# Altium project PCB-Tester-Board-V1.PrjPcb (part 1 of 3)
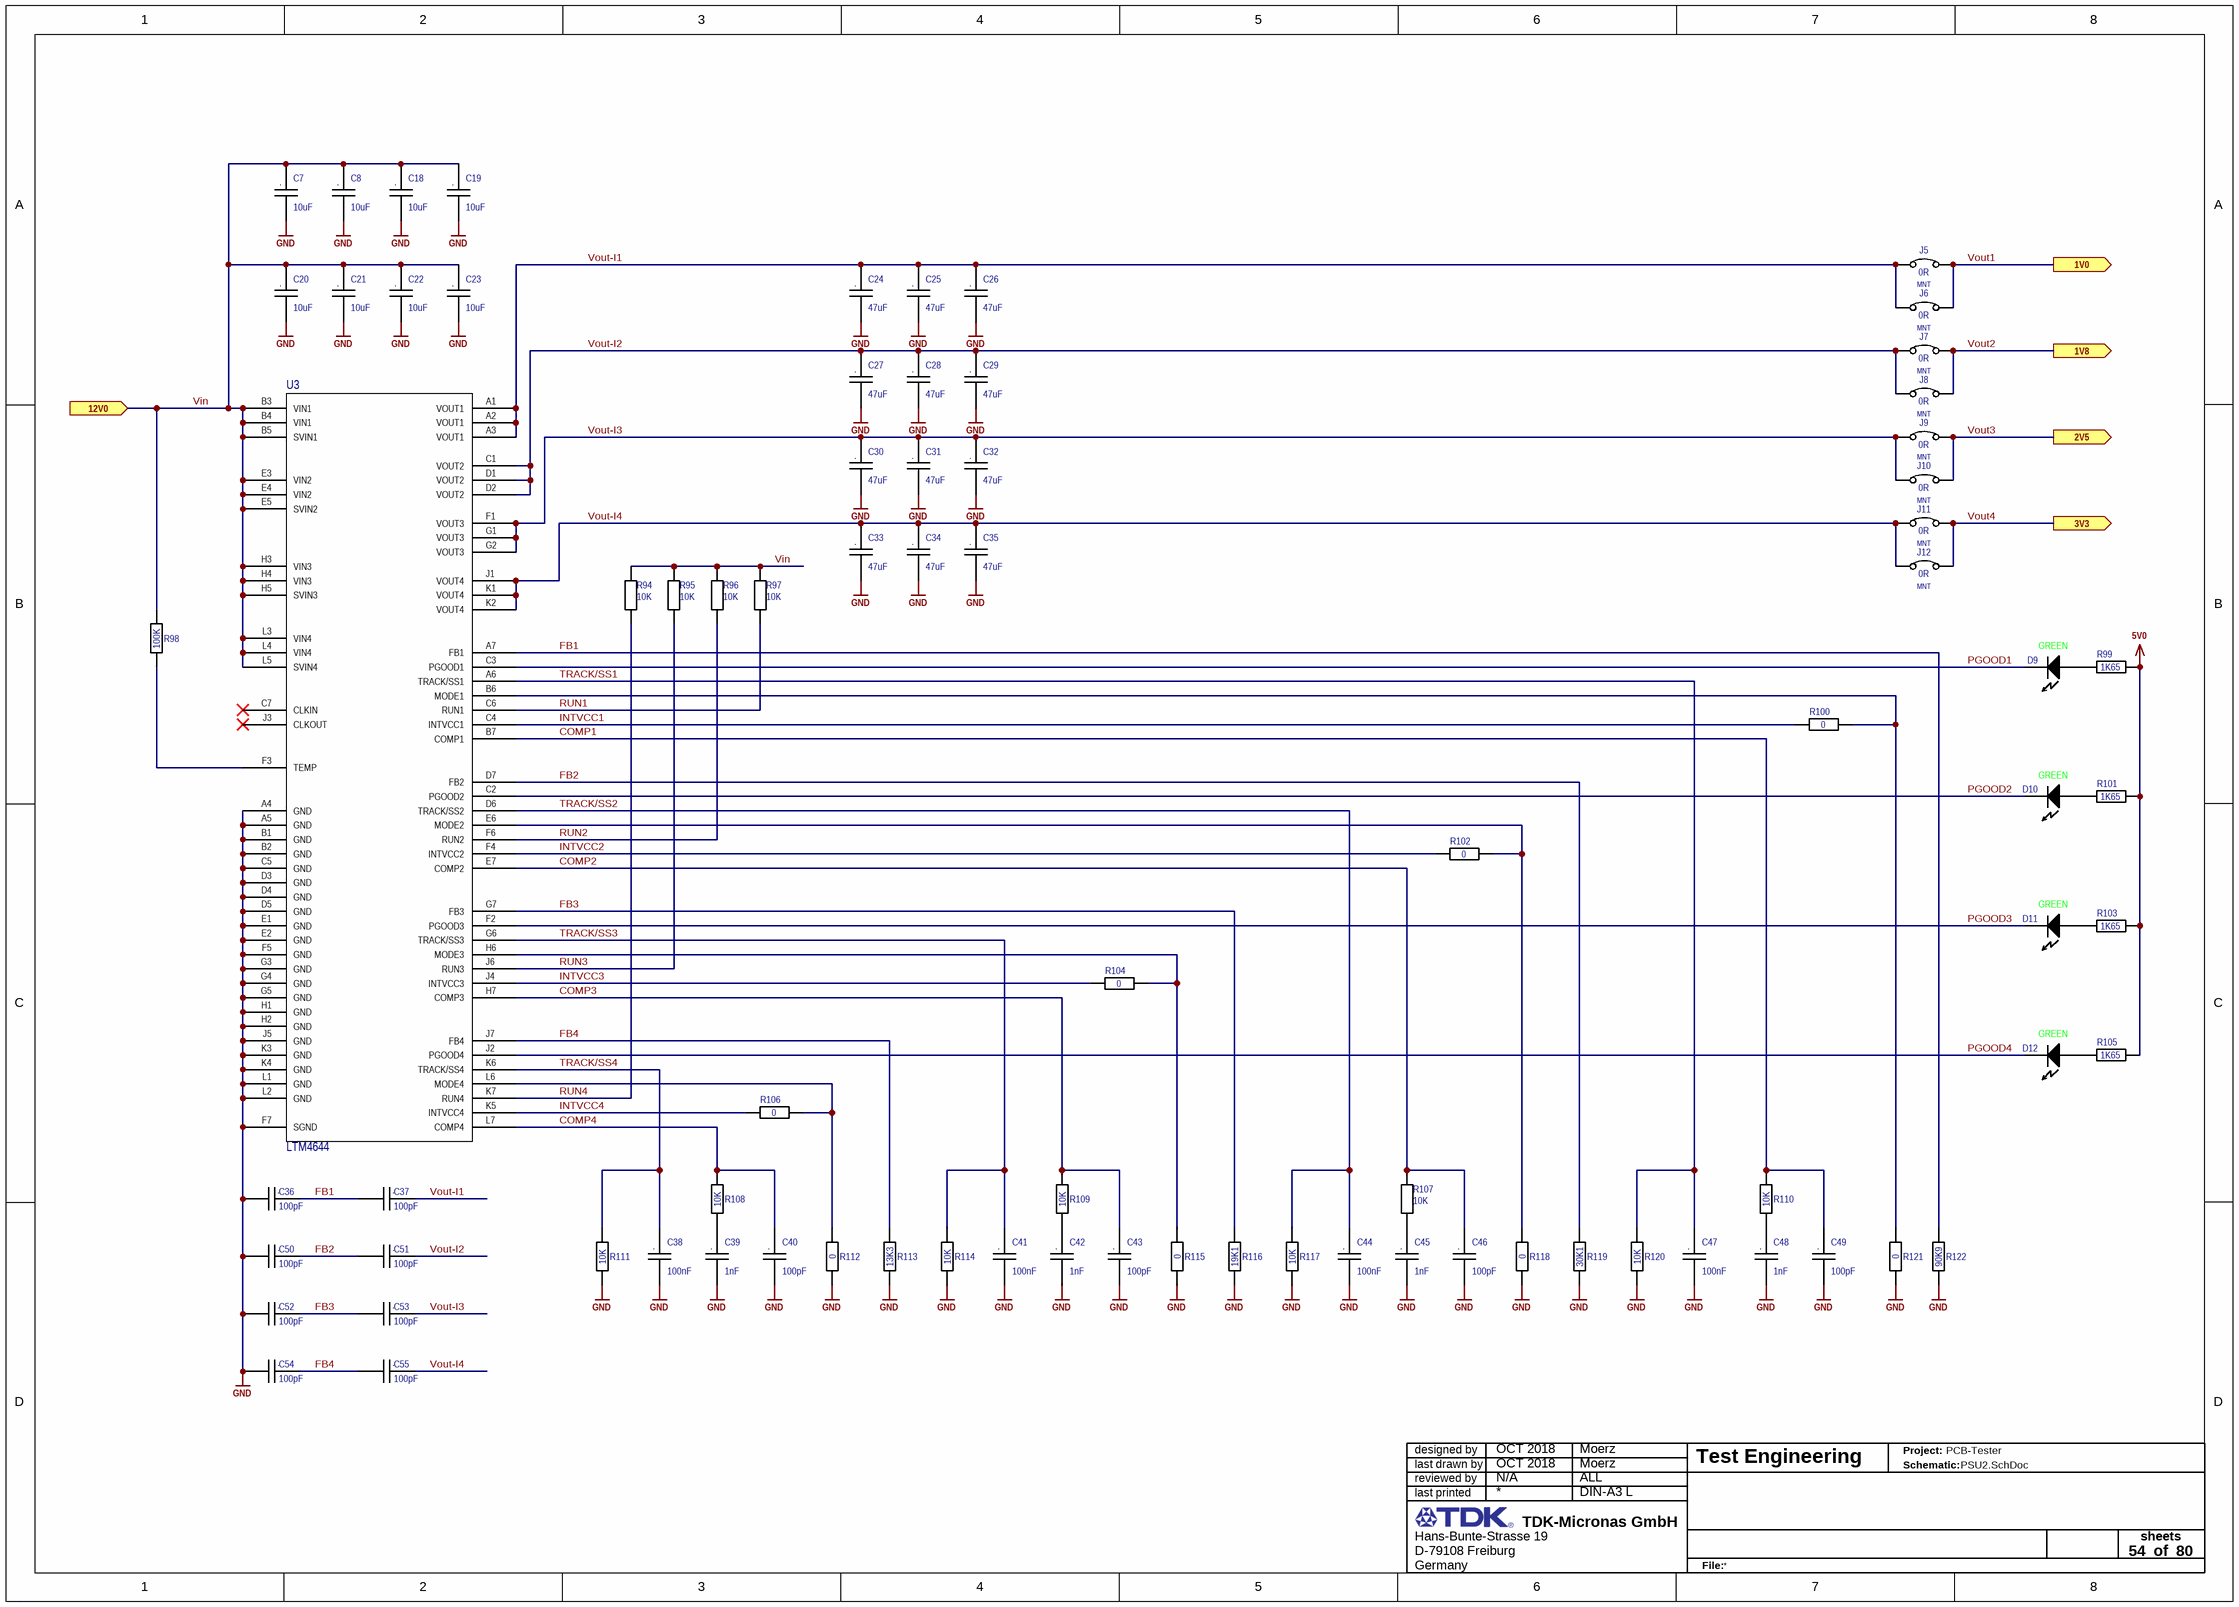
[diagram p0: PSU2.SchDoc]
A_Number: A33003; Board: PCB-Tester-Board; BoardNumber: U33xxx; MajorRevision: 1; MinorRevision: 0; Project: PCB-Tester; Team: Test Engineering; U_Number: U33xxx
13 sheets, 574 parts. Net scope: hierarchical (ports join the sheet entries above them; power ports are global).
Board file: PCB-Tester-Board-V1.PcbDoc
Sheets:
  PSU2.SchDoc
  X7A15T-Decoupling.SchDoc
  PCB-Tester-Board-V1.SchDoc
    Instrument1 = Instrument.SchDoc
    Instrument2 = Instrument.SchDoc
    Instrument3 = Instrument.SchDoc
    Instrument4 = Instrument.SchDoc
    Instrument5 = Instrument.SchDoc
    Instrument6 = Instrument.SchDoc
    Instrument7 = Instrument.SchDoc
    Instrument8 = Instrument.SchDoc
    Controller = Controller.SchDoc
      ADC = ADC.SchDoc
      RelayDriver = RelayDriver.SchDoc
        X7A15T-Prog = X7A15T-Prog.SchDoc
        X7A15T-Fabric = X7A15T-Fabric.SchDoc
      Input = Input.SchDoc
      Output = Output.SchDoc
      Output = Output.SchDoc
      Output = Output.SchDoc
      Output = Output.SchDoc
      Output = Output.SchDoc
      Input = Input.SchDoc
      Input = Input.SchDoc
      Input = Input.SchDoc
      Input = Input.SchDoc
    Power Routing = PowerRouting.SchDoc
    Signal Routing = SignalRouting.SchDoc

## Sheet PSU2.SchDoc: =Board +' X7A15T-PSU-LTTM4644'
size A3; Date: OCT 2018; CheckedBy: ALL; Author: Moerz; CompanyName: TDK-Micronas GmbH; DrawnBy: Moerz; Engineer: Moerz; Organization: Test Engineering; Address1: Hans-Bunte-Strasse 19; Address2: D-79108 Freiburg; Address3: Germany; DocumentNumber: U33xxx-S; Revision: V1.0; SheetNumber: 54; SheetTotal: 80; DateDraw: OCT 2018; DateChecked: N/A; PageSetup: Record=PageOptions|CenterHorizontal=True|CenterVertical=True|PrintScale=0.97|XCorrection=1.00|YCorrection=1.00|PrintKind=0|BorderSize=5000000|LeftOffset=0|BottomOffset=0|Orientation=2|PaperLength=1000|PaperWidth=1000|Scale=100|PaperSource=7|PrintQuality=-3|MediaType=1|DitherType=10|PrintScaleMode=1|PaperKind=A4|PaperIndex=9; TitleTyp: Title-Typ; Block: CPU & SCT8; Workspace: Workspace

### Parts
C7  value 10uF  [C1206 Reflow]  (hidden comment: C)
C8  value 10uF  [C1206 Reflow]  (hidden comment: C)
C18  value 10uF  [C1206 Reflow]  (hidden comment: C)
C19  value 10uF  [C1206 Reflow]  (hidden comment: C)
C20  value 10uF  [C1206 Reflow]  (hidden comment: C)
C21  value 10uF  [C1206 Reflow]  (hidden comment: C)
C22  value 10uF  [C1206 Reflow]  (hidden comment: C)
C23  value 10uF  [C1206 Reflow]  (hidden comment: C)
C24  value 47uF  [C1210 Reflow]  (hidden comment: C)
C25  value 47uF  [C1210 Reflow]  (hidden comment: C)
C26  value 47uF  [C1210 Reflow]  (hidden comment: C)
C27  value 47uF  [C1210 Reflow]  (hidden comment: C)
C28  value 47uF  [C1210 Reflow]  (hidden comment: C)
C29  value 47uF  [C1210 Reflow]  (hidden comment: C)
C30  value 47uF  [C1210 Reflow]  (hidden comment: C)
C31  value 47uF  [C1210 Reflow]  (hidden comment: C)
C32  value 47uF  [C1210 Reflow]  (hidden comment: C)
C33  value 47uF  [C1210 Reflow]  (hidden comment: C)
C34  value 47uF  [C1210 Reflow]  (hidden comment: C)
C35  value 47uF  [C1210 Reflow]  (hidden comment: C)
C36  value 100pF  [C0402 Reflow]  (hidden comment: C)
C37  value 100pF  [C0402 Reflow]  (hidden comment: C)
C38  value 100nF  [C0402 Reflow]  (hidden comment: C)
C39  value 1nF  [C0402 Reflow]  (hidden comment: C)
C40  value 100pF  [C0402 Reflow]  (hidden comment: C)
C41  value 100nF  [C0402 Reflow]  (hidden comment: C)
C42  value 1nF  [C0402 Reflow]  (hidden comment: C)
C43  value 100pF  [C0402 Reflow]  (hidden comment: C)
C44  value 100nF  [C0402 Reflow]  (hidden comment: C)
C45  value 1nF  [C0402 Reflow]  (hidden comment: C)
C46  value 100pF  [C0402 Reflow]  (hidden comment: C)
C47  value 100nF  [C0402 Reflow]  (hidden comment: C)
C48  value 1nF  [C0402 Reflow]  (hidden comment: C)
C49  value 100pF  [C0402 Reflow]  (hidden comment: C)
C50  value 100pF  [C0402 Reflow]  (hidden comment: C)
C51  value 100pF  [C0402 Reflow]  (hidden comment: C)
C52  value 100pF  [C0402 Reflow]  (hidden comment: C)
C53  value 100pF  [C0402 Reflow]  (hidden comment: C)
C54  value 100pF  [C0402 Reflow]  (hidden comment: C)
C55  value 100pF  [C0402 Reflow]  (hidden comment: C)
D9  Color: GREEN  [L0603G]  (hidden comment: D)
D10  Color: GREEN  [L0603G]  (hidden comment: D)
D11  Color: GREEN  [L0603G]  (hidden comment: D)
D12  Color: GREEN  [L0603G]  (hidden comment: D)
J5  value 0R  POPULATED: MNT  [JumperSMD]  (hidden comment: J)
J6  value 0R  POPULATED: MNT  [JumperSMD]  (hidden comment: J)
J7  value 0R  POPULATED: MNT  [JumperSMD]  (hidden comment: J)
J8  value 0R  POPULATED: MNT  [JumperSMD]  (hidden comment: J)
J9  value 0R  POPULATED: MNT  [JumperSMD]  (hidden comment: J)
J10  value 0R  POPULATED: MNT  [JumperSMD]  (hidden comment: J)
J11  value 0R  POPULATED: MNT  [JumperSMD]  (hidden comment: J)
J12  value 0R  POPULATED: MNT  [JumperSMD]  (hidden comment: J)
R94  value 10K  [R0402 Reflow]  (hidden comment: R)
R95  value 10K  [R0402 Reflow]  (hidden comment: R)
R96  value 10K  [R0402 Reflow]  (hidden comment: R)
R97  value 10K  [R0402 Reflow]  (hidden comment: R)
R98  value 100K  [R0402 Reflow]  (hidden comment: R)
R99  value 1K65  [R0402 Reflow]  (hidden comment: R)
R100  value 0  [R0402 Reflow]  (hidden comment: R)
R101  value 1K65  [R0402 Reflow]  (hidden comment: R)
R102  value 0  [R0402 Reflow]  (hidden comment: R)
R103  value 1K65  [R0402 Reflow]  (hidden comment: R)
R104  value 0  [R0402 Reflow]  (hidden comment: R)
R105  value 1K65  [R0402 Reflow]  (hidden comment: R)
R106  value 0  [R0402 Reflow]  (hidden comment: R)
R107  value 10K  [R0402 Reflow]  (hidden comment: R)
R108  value 10K  [R0402 Reflow]  (hidden comment: R)
R109  value 10K  [R0402 Reflow]  (hidden comment: R)
R110  value 10K  [R0402 Reflow]  (hidden comment: R)
R111  value 10K  [R0402 Reflow]  (hidden comment: R)
R112  value 0  [R0402 Reflow]  (hidden comment: R)
R113  value 13K3  [R0402 Reflow]  (hidden comment: R)
R114  value 10K  [R0402 Reflow]  (hidden comment: R)
R115  value 0  [R0402 Reflow]  (hidden comment: R)
R116  value 19K1  [R0402 Reflow]  (hidden comment: R)
R117  value 10K  [R0402 Reflow]  (hidden comment: R)
R118  value 0  [R0402 Reflow]  (hidden comment: R)
R119  value 30K1  [R0402 Reflow]  (hidden comment: R)
R120  value 10K  [R0402 Reflow]  (hidden comment: R)
R121  value 0  [R0402 Reflow]  (hidden comment: R)
R122  value 90K9  [R0402 Reflow]  (hidden comment: R)
U3  U  [LTM4644]  (value not drawn)

### Ports
1V0 (out), 1V8 (out), 2V5 (out), 3V3 (out), 12V0 (in)

### Nets
5V0: R99.2 R101.2 R103.2 R105.2
GND: C7.2 C8.2 C18.2 C19.2 C20.2 C21.2 C22.2 C23.2 C24.2 C25.2 C26.2 C27.2 C28.2 C29.2 C30.2 C31.2 C32.2 C33.2 C34.2 C35.2 C36.2 C38.2 C39.2 C40.2 C41.2 C42.2 C43.2 C44.2 C45.2 C46.2 C47.2 C48.2 C49.2 C50.2 C52.2 C54.2 R111.1 R112.1 R113.1 R114.1 R115.1 R116.1 R117.1 R118.1 R119.1 R120.1 R121.1 R122.1 U3.A4(GND) U3.A5(GND) U3.B1(GND) U3.B2(GND) U3.C5(GND) U3.D3(GND) U3.D4(GND) U3.D5(GND) U3.E1(GND) U3.E2(GND) U3.F5(GND) U3.F7(SGND) U3.G3(GND) U3.G4(GND) U3.G5(GND) U3.H1(GND) U3.H2(GND) U3.J5(GND) U3.K3(GND) U3.K4(GND) U3.L1(GND) U3.L2(GND)
COMP1: C49.1 R110.2 U3.B7(COMP1)  [project net COMP1_54]
COMP2: C46.1 R107.2 U3.E7(COMP2)  [project net COMP2_54]
COMP3: C43.1 R109.2 U3.H7(COMP3)  [project net COMP3_54]
COMP4: C40.1 R108.2 U3.L7(COMP4)  [project net COMP4_54]
FB1: C36.1 C37.2 R122.2 U3.A7(FB1)  [project net FB1_54]
FB2: C50.1 C51.2 R119.2 U3.D7(FB2)  [project net FB2_54]
FB3: C52.1 C53.2 R116.2 U3.G7(FB3)  [project net FB3_54]
FB4: C54.1 C55.2 R113.2 U3.J7(FB4)  [project net FB4_54]
INTVCC1: R100.2 U3.C4(INTVCC1)  [project net INTVCC1_54]
INTVCC2: R102.2 U3.F4(INTVCC2)  [project net INTVCC2_54]
INTVCC3: R104.2 U3.J4(INTVCC3)  [project net INTVCC3_54]
INTVCC4: R106.2 U3.K5(INTVCC4)  [project net INTVCC4_54]
PGOOD1: D9.2(Cathode) U3.C3(PGOOD1)  [project net PGOOD1_54]
PGOOD2: D10.2(Cathode) U3.C2(PGOOD2)  [project net PGOOD2_54]
PGOOD3: D11.2(Cathode) U3.F2(PGOOD3)  [project net PGOOD3_54]
PGOOD4: D12.2(Cathode) U3.J2(PGOOD4)  [project net PGOOD4_54]
RUN1: R97.1 U3.C6(RUN1)  [project net RUN1_54]
RUN2: R96.1 U3.F6(RUN2)  [project net RUN2_54]
RUN3: R95.1 U3.J6(RUN3)  [project net RUN3_54]
RUN4: R94.1 U3.K7(RUN4)  [project net RUN4_54]
TRACK/SS1: C47.1 R120.2 U3.A6(TRACK/SS1)  [project net TRACK/SS1_54]
TRACK/SS2: C44.1 R117.2 U3.D6(TRACK/SS2)  [project net TRACK/SS2_54]
TRACK/SS3: C41.1 R114.2 U3.G6(TRACK/SS3)  [project net TRACK/SS3_54]
TRACK/SS4: C38.1 R111.2 U3.K6(TRACK/SS4)  [project net TRACK/SS4_54]
Vin: C7.1 C8.1 C18.1 C19.1 C20.1 C21.1 C22.1 C23.1 R94.2 R95.2 R96.2 R97.2 R98.2 U3.B3(VIN1) U3.B4(VIN1) U3.B5(SVIN1) U3.E3(VIN2) U3.E4(VIN2) U3.E5(SVIN2) U3.H3(VIN3) U3.H4(VIN3) U3.H5(SVIN3) U3.L3(VIN4) U3.L4(VIN4) U3.L5(SVIN4) ; port 12V0
Vout1: J5.2 J6.2 ; port 1V0
Vout2: J7.2 J8.2 ; port 1V8
Vout3: J9.2 J10.2 ; port 2V5
Vout4: J11.2 J12.2 ; port 3V3
Vout-I1: C24.1 C25.1 C26.1 C37.1 J5.1 J6.1 U3.A1(VOUT1) U3.A2(VOUT1) U3.A3(VOUT1)  [project net Vout-I1_54]
Vout-I2: C27.1 C28.1 C29.1 C51.1 J7.1 J8.1 U3.C1(VOUT2) U3.D1(VOUT2) U3.D2(VOUT2)  [project net Vout-I2_54]
Vout-I3: C30.1 C31.1 C32.1 C53.1 J9.1 J10.1 U3.F1(VOUT3) U3.G1(VOUT3) U3.G2(VOUT3)  [project net Vout-I3_54]
Vout-I4: C33.1 C34.1 C35.1 C55.1 J11.1 J12.1 U3.J1(VOUT4) U3.K1(VOUT4) U3.K2(VOUT4)  [project net Vout-I4_54]
NetC39_1: C39.1 R108.1
NetC42_1: C42.1 R109.1
NetC45_1: C45.1 R107.1
NetC48_1: C48.1 R110.1
NetD9_1: D9.1(Anode) R99.1
NetD10_1: D10.1(Anode) R101.1
NetD11_1: D11.1(Anode) R103.1
NetD12_1: D12.1(Anode) R105.1
NetR98_1: R98.1 U3.F3(TEMP)
NetR100_1: R100.1 R121.2 U3.B6(MODE1)
NetR102_1: R102.1 R118.2 U3.E6(MODE2)
NetR104_1: R104.1 R115.2 U3.H6(MODE3)
NetR106_1: R106.1 R112.2 U3.L6(MODE4)

Not connected (* = marked no-connect by the designer): U3 C7(CLKIN)* J3(CLKOUT)*

### Notes on the sheet
- designed by
- reviewed by
- last drawn by
- Project:
- Schematic:
- last printed
- DIN-A3 L
- sheets
- of
- File:
- (in symbol C) .

### Library data of the parts
C7 C8 C18-C23 = C: CAP CER 10UF 25V X7R 1206; 04. Manufacturer: TDK Corporation; 07. Manufacturer  Part Number: C3216X7R1E106K160AB; Tolerance: ±10%; 03. Unit Price: 0.66; 13. Created Date/Name: AUG2018/Hören; Voltage Rating: 25V; Type: X7R; ComponentLink1Description: Info; ComponentLink1URL: https://www.digikey.de/products/en?keywords=445-7705-6-ND; 02. Distributor Part Number: 445-7705-6-ND; 09. Operating Temperature: -55°C ~ 125°C; 11. RoHS: YES; 01. Distributor: DigiKey; ComponentLink2Description: DataSheet; Package: 1206
C24-C35 = C: CAP CER 47UF 10V X5R 1210; 04. Manufacturer: Samsung Electro-Mechanics; 07. Manufacturer  Part Number: CL32A476MPJNNNE; Tolerance: ±20%; 03. Unit Price: 0.88; 13. Created Date/Name: AUG2018/Hören; Voltage Rating: 10V; Type: X5R; ComponentLink1Description: Info; ComponentLink1URL: *; 02. Distributor Part Number: 1276-3380-6-ND; 09. Operating Temperature: -55°C ~ 85°C; 11. RoHS: YES; 01. Distributor: DigiKey; ComponentLink2Description: DataSheet; Package: 1210
C36 C37 C40 C43 C46 C49-C55 = C: CAP CER 100PF 25V C0G/NP0 0402; 04. Manufacturer: KEMET; 07. Manufacturer  Part Number: C0402C101J3GACTU; Tolerance: ±5%; Type: C0G, NP0; 03. Unit Price: 0.09; 13. Created Date/Name: AUG2018/Hören; Voltage Rating: 25V; ComponentLink1Description: Info; ComponentLink1URL: https://www.digikey.de/products/en?keywords=399-1022-6-ND; 02. Distributor Part Number: 399-1022-6-ND; 09. Operating Temperature: -55°C ~ 125°C; 11. RoHS: YES; 01. Distributor: DigiKey; ComponentLink2Description: DataSheet; Package: 0402
C38 C41 C44 C47 = C: CAP CER 0.1UF 25V X7R 0402; 04. Manufacturer: Yageo; 07. Manufacturer  Part Number: CC0402KRX7R8BB104; Tolerance: ±10%; 03. Unit Price: 0.09; 13. Created Date/Name: AUG2018/Hören; Voltage Rating: 25V; Type: X7R; ComponentLink1Description: Info; ComponentLink1URL: https://www.digikey.de/products/en?keywords=311-2077-6-ND; 02. Distributor Part Number: 311-2077-6-ND; 09. Operating Temperature: -55°C ~ 125°C; 11. RoHS: YES; 01. Distributor: DigiKey; ComponentLink2Description: DataSheet; Package: 0402
C39 C42 C45 C48 = C: CAP CER 1000PF 25V X7R 0402; 04. Manufacturer: KEMET; 07. Manufacturer  Part Number: C0402C102K3RACTU; Tolerance: ±10%; 03. Unit Price: 0.09; 13. Created Date/Name: AUG2018/Hören; Voltage Rating: 25V; Type: X7R; ComponentLink1Description: Info; ComponentLink1URL: https://www.digikey.de/products/en?keywords=399-1031-6-ND; 02. Distributor Part Number: 399-1031-6-ND; 09. Operating Temperature: -55°C ~ 125°C; 11. RoHS: YES; 01. Distributor: DigiKey; ComponentLink2Description: DataSheet; Package: 0402
D9-D12 = LED: LED GREEN DIFFUSED 0603 SMD; 04. Manufacturer: OSRAM Opto Semiconductors Inc.; 07. Manufacturer  Part Number: LG L29K-G2J1-24-Z; Vf: 1.7V; If: 2mA; Wave Length: 570nm; Viewing Angle: 160°; 03. Unit Price: 0.4; 13. Created Date/Name: AUG2018/Hören; ComponentLink1Description: Info; ComponentLink1URL: https://www.digikey.de/products/en?keywords=475-2709-6-ND; ComponentLink2Description: DataSheet; ComponentLink2URL: https://www.digikey.de/products/en?keywords=475-2709-6-ND; 02. Distributor Part Number: 475-2709-6-ND; 11. RoHS: YES; 01. Distributor: DigiKey
J5-J12 = Jumper SMD: RES SMD 0 OHM JUMPER 1/10W 0603; 04. Manufacturer: Yageo; 07. Manufacturer  Part Number: RC0603JR-070RL; 03. Unit Price: 0.09; 01. Distributor: DigiKey; 02. Distributor Part Number: 311-0.0GRDKR-ND; 09. Operating Temperature: -55°C ~ 155°C; 11. RoHS: YES; Package: 0603; ComponentLink4Description: Info; ComponentLink4URL: https://www.digikey.de/product-detail/en/yageo/RC0603JR-070RL/311-0.0GRDKR-ND/732569; ComponentLink5Description: DataSheet; ComponentLink5URL: http://www.yageo.com/documents/recent/PYu-RC_Group_51_RoHS_L_10.pdf
R94-R97 R107-R111 R114 R117 R120 = R: RES SMD 10K OHM 1% 1/16W 0402; 04. Manufacturer: Yageo; 07. Manufacturer  Part Number: RC0402FR-0710KL; 03. Unit Price: 0.09; 13. Created Date/Name: AUG2018/Hören; Power Rating: 63mW; Tolerance: ±1%; ComponentLink1URL: https://www.digikey.de/products/en?keywords=311-10.0KLRDKR-ND; ComponentLink1Description: Info; 02. Distributor Part Number: 311-10.0KLRDKR-ND; 09. Operating Temperature: -55°C ~ 155°C; 11. RoHS: YES; 01. Distributor: DigiKey; ComponentLink2Description: DataSheet; Type: Thick Film; Package: 0402
R98 = R: RES SMD 100K OHM 1% 1/16W 0402; 04. Manufacturer: Yageo; 07. Manufacturer  Part Number: RC0402FR-07100KL; 03. Unit Price: 0.09; 13. Created Date/Name: AUG2018/Hören; Power Rating: 63mW; Tolerance: ±1%; ComponentLink1URL: *; ComponentLink1Description: Info; 02. Distributor Part Number: 311-100KLRDKR-ND; 09. Operating Temperature: -55°C ~ 155°C; 11. RoHS: YES; 01. Distributor: DigiKey; ComponentLink2Description: DataSheet; Type: Thick Film; Package: 0402
R99 R101 R103 R105 = R: RES SMD 1.65K OHM 1% 1/16W 0402; 04. Manufacturer: Yageo; 07. Manufacturer  Part Number: RC0402FR-071K65L; 03. Unit Price: 0.09; 13. Created Date/Name: AUG2018/Hören; Power Rating: 63mW; Tolerance: ±1%; ComponentLink1URL: https://www.digikey.de/product-detail/en/yageo/RC0402FR-071K65L/YAG3043DKR-ND/5282914; ComponentLink1Description: Info; 02. Distributor Part Number: YAG3043DKR-ND; 09. Operating Temperature: -55°C ~ 155°C; 11. RoHS: YES; 01. Distributor: DigiKey; ComponentLink2Description: DataSheet; Type: Thick Film; Package: 0402
R100 R102 R104 R106 R112 R115 R118 R121 = R: RES SMD 0 OHM JUMPER 1/16W 0402; 04. Manufacturer: Yageo; 07. Manufacturer  Part Number: RC0402JR-070RL; 03. Unit Price: 0.09; 13. Created Date/Name: AUG2018/Hören; Power Rating: 63mW; ComponentLink1URL: https://www.digikey.de/products/en?keywords=311-0.0JRDKR-ND; ComponentLink1Description: Info; 02. Distributor Part Number: 311-0.0JRDKR-ND; 09. Operating Temperature: -55°C ~ 155°C; 11. RoHS: YES; 01. Distributor: DigiKey; ComponentLink2Description: DataSheet; Type: Thick Film; Package: 0402
R113 = R: RES SMD 13.3K OHM 1% 1/16W 0402; 04. Manufacturer: Yageo; 07. Manufacturer  Part Number: RC0402FR-0713K3L; 03. Unit Price: 0.09; 13. Created Date/Name: AUG2018/Hören; Power Rating: 63mW; Tolerance: ±1%; ComponentLink1URL: https://www.digikey.de/products/en?keywords=YAG2974DKR-ND; ComponentLink1Description: Info; 02. Distributor Part Number: YAG2974DKR-ND; 09. Operating Temperature: -55°C ~ 155°C; 11. RoHS: YES; 01. Distributor: DigiKey; ComponentLink2Description: DataSheet; Type: Thick Film; Package: 0402
R116 = R: RES SMD 19.1K OHM 1% 1/16W 0402; 04. Manufacturer: Yageo; 07. Manufacturer  Part Number: RC0402FR-0719K1L; 03. Unit Price: 0.09; 13. Created Date/Name: AUG2018/Hören; Power Rating: 63mW; Tolerance: ±1%; ComponentLink1URL: *; ComponentLink1Description: Info; 02. Distributor Part Number: 311-19.1KLRDKR-ND; 09. Operating Temperature: -55°C ~ 155°C; 11. RoHS: YES; 01. Distributor: DigiKey; ComponentLink2Description: DataSheet; Type: Thick Film; Package: 0402
R119 = R: RES SMD 30.1K OHM 1% 1/16W 0402; 04. Manufacturer: Yageo; 07. Manufacturer  Part Number: RC0402FR-0730K1L; 03. Unit Price: 0.09; 13. Created Date/Name: AUG2018/Hören; Power Rating: 63mW; Tolerance: ±1%; ComponentLink1URL: https://www.digikey.de/products/en?keywords=311-30.1KLRDKR-ND; ComponentLink1Description: Info; 02. Distributor Part Number: 311-30.1KLRDKR-ND; 09. Operating Temperature: -55°C ~ 155°C; 11. RoHS: YES; 01. Distributor: DigiKey; ComponentLink2Description: DataSheet; Type: Thick Film; Package: 0402
R122 = R: RES SMD 90.9K OHM 1% 1/16W 0402; 04. Manufacturer: Yageo; 07. Manufacturer  Part Number: RC0402FR-0790K9L; 03. Unit Price: 0.09; 13. Created Date/Name: AUG2018/Hören; Power Rating: 63mW; Tolerance: ±1%; ComponentLink1URL: *; ComponentLink1Description: Info; 02. Distributor Part Number: 311-90.9KLRDKR-ND; 09. Operating Temperature: -55°C ~ 155°C; 11. RoHS: YES; 01. Distributor: DigiKey; ComponentLink2Description: DataSheet; Type: Thick Film; Package: 0402
U3 = LTM4644: DC DC CONVERTER 4X0.6-5.5V; MFR-PN: LTM4644EY#PBF; MFR: LINEAR TECHNOLOGY; 04. Manufacturer: Linear Technology/Analog Devices; POPULATED: yes; 03. Unit Price: 39.30; 01. Distributor: DigiKey; 02. Distributor Part Number: LTM4644EY#PBF-ND; 07. Manufacturer  Part Number: LTM4644EY#PBF; 09. Operating Temperature: -40°C ~ 125°C; 11. RoHS: YES; ComponentLink4Description: Info; ComponentLink4URL: https://www.digikey.de/products/en?keywords=LTM4644EY%23PBF; ComponentLink5Description: DataSheet; ComponentLink5URL: http://www.analog.com/media/en/technical-documentation/data-sheets/4644fe.pdf; NicName: LTM4644

## Sheet X7A15T-Decoupling.SchDoc: =Board +' X7A15T-Decoupling'
size A4 portrait; Organization: Test Engineering; Address1: Hans-Bunte-Strasse 19; Address2: D-79108 Freiburg; Address3: Germany; DocumentNumber: U33xxx-S; Revision: V1.0; SheetNumber: 6; SheetTotal: 80; Date: OCT 2018; CheckedBy: ALL; Author: Moerz; CompanyName: TDK-Micronas GmbH; DrawnBy: Moerz; Engineer: Moerz; DateDraw: OCT 2018; DateChecked: N/A; PageSetup: Record=PageOptions|CenterHorizontal=True|CenterVertical=True|PrintScale=0.97|XCorrection=1.00|YCorrection=1.00|PrintKind=0|BorderSize=5000000|LeftOffset=0|BottomOffset=0|Orientation=2|PaperLength=1000|PaperWidth=1000|Scale=100|PaperSource=7|PrintQuality=-3|MediaType=1|DitherType=10|PrintScaleMode=1|PaperKind=A4|PaperIndex=9; TitleTyp: Title-Typ; Block: CPU & SCT8; Workspace: Workspace
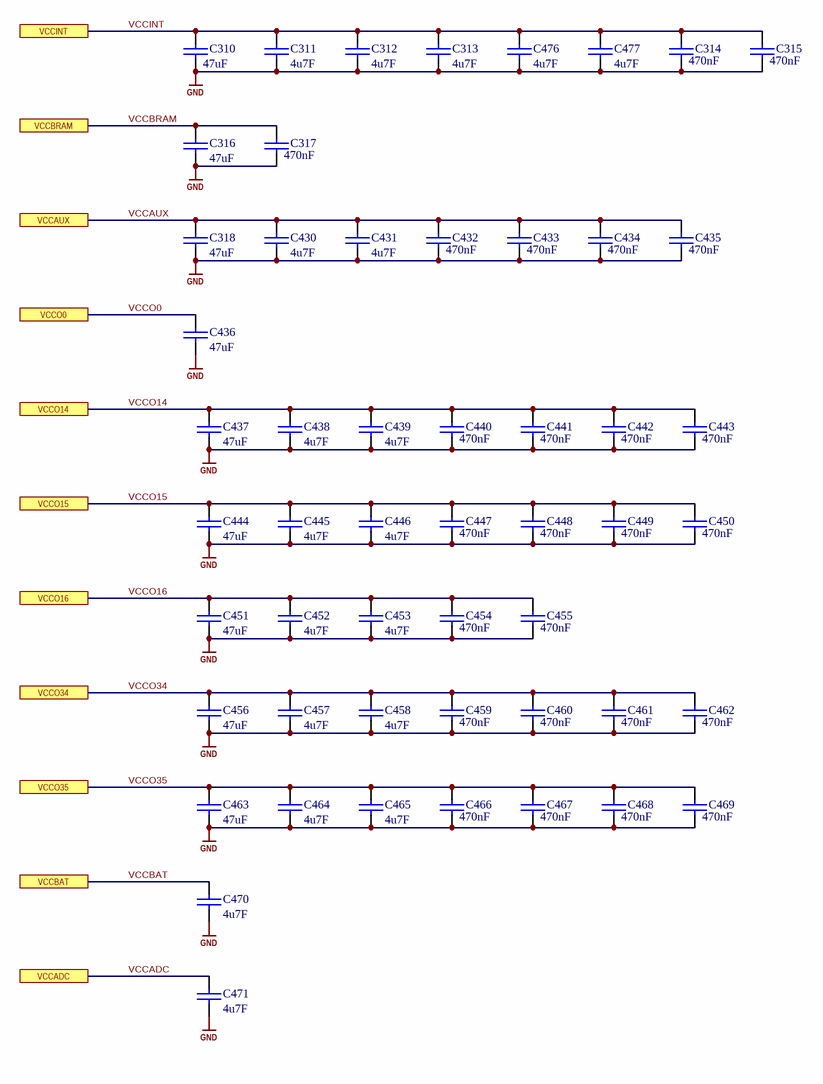
[diagram p1: X7A15T-Decoupling.SchDoc]

### Parts
C310  value 47uF  [C1206 Reflow]  (hidden comment: C)
C311  value 4u7F  [C0402 RevOne]  (hidden comment: C)
C312  value 4u7F  [C0402 RevOne]  (hidden comment: C)
C313  value 4u7F  [C0402 RevOne]  (hidden comment: C)
C314  value 470nF  [C0402 RevOne]  (hidden comment: C)
C315  value 470nF  [C0402 RevOne]  (hidden comment: C)
C316  value 47uF  [C0805 Reflow]  (hidden comment: C)
C317  value 470nF  [C0402 RevOne]  (hidden comment: C)
C318  value 47uF  [C0805 Reflow]  (hidden comment: C)
C430  value 4u7F  [C0402 RevOne]  (hidden comment: C)
C431  value 4u7F  [C0402 RevOne]  (hidden comment: C)
C432  value 470nF  [C0402 RevOne]  (hidden comment: C)
C433  value 470nF  [C0402 RevOne]  (hidden comment: C)
C434  value 470nF  [C0402 RevOne]  (hidden comment: C)
C435  value 470nF  [C0402 RevOne]  (hidden comment: C)
C436  value 47uF  [C0805 Reflow]  (hidden comment: C)
C437  value 47uF  [C0805 Reflow]  (hidden comment: C)
C438  value 4u7F  [C0402 RevOne]  (hidden comment: C)
C439  value 4u7F  [C0402 RevOne]  (hidden comment: C)
C440  value 470nF  [C0402 RevOne]  (hidden comment: C)
C441  value 470nF  [C0402 RevOne]  (hidden comment: C)
C442  value 470nF  [C0402 RevOne]  (hidden comment: C)
C443  value 470nF  [C0402 RevOne]  (hidden comment: C)
C444  value 47uF  [C0805 Reflow]  (hidden comment: C)
C445  value 4u7F  [C0402 RevOne]  (hidden comment: C)
C446  value 4u7F  [C0402 RevOne]  (hidden comment: C)
C447  value 470nF  [C0402 RevOne]  (hidden comment: C)
C448  value 470nF  [C0402 RevOne]  (hidden comment: C)
C449  value 470nF  [C0402 RevOne]  (hidden comment: C)
C450  value 470nF  [C0402 RevOne]  (hidden comment: C)
C451  value 47uF  [C0805 Reflow]  (hidden comment: C)
C452  value 4u7F  [C0402 RevOne]  (hidden comment: C)
C453  value 4u7F  [C0402 RevOne]  (hidden comment: C)
C454  value 470nF  [C0402 RevOne]  (hidden comment: C)
C455  value 470nF  [C0402 RevOne]  (hidden comment: C)
C456  value 47uF  [C0805 Reflow]  (hidden comment: C)
C457  value 4u7F  [C0402 RevOne]  (hidden comment: C)
C458  value 4u7F  [C0402 RevOne]  (hidden comment: C)
C459  value 470nF  [C0402 RevOne]  (hidden comment: C)
C460  value 470nF  [C0402 RevOne]  (hidden comment: C)
C461  value 470nF  [C0402 RevOne]  (hidden comment: C)
C462  value 470nF  [C0402 RevOne]  (hidden comment: C)
C463  value 47uF  [C0805 Reflow]  (hidden comment: C)
C464  value 4u7F  [C0402 RevOne]  (hidden comment: C)
C465  value 4u7F  [C0402 RevOne]  (hidden comment: C)
C466  value 470nF  [C0402 RevOne]  (hidden comment: C)
C467  value 470nF  [C0402 RevOne]  (hidden comment: C)
C468  value 470nF  [C0402 RevOne]  (hidden comment: C)
C469  value 470nF  [C0402 RevOne]  (hidden comment: C)
C470  value 4u7F  [C0402 RevOne]  (hidden comment: C)
C471  value 4u7F  [C0402 RevOne]  (hidden comment: C)
C476  value 4u7F  [C0402 RevOne]  (hidden comment: C)
C477  value 4u7F  [C0402 RevOne]  (hidden comment: C)

### Ports
VCCADC, VCCAUX, VCCBAT, VCCBRAM, VCCINT, VCCO0, VCCO14, VCCO15, VCCO16, VCCO34, VCCO35

### Nets
GND: C310.2 C311.2 C312.2 C313.2 C314.2 C315.2 C316.2 C317.2 C318.2 C430.2 C431.2 C432.2 C433.2 C434.2 C435.2 C436.2 C437.2 C438.2 C439.2 C440.2 C441.2 C442.2 C443.2 C444.2 C445.2 C446.2 C447.2 C448.2 C449.2 C450.2 C451.2 C452.2 C453.2 C454.2 C455.2 C456.2 C457.2 C458.2 C459.2 C460.2 C461.2 C462.2 C463.2 C464.2 C465.2 C466.2 C467.2 C468.2 C469.2 C470.2 C471.2 C476.2 C477.2
VCCADC: C471.1 ; port VCCADC
VCCAUX: C318.1 C430.1 C431.1 C432.1 C433.1 C434.1 C435.1 ; port VCCAUX
VCCBAT: C470.1 ; port VCCBAT
VCCBRAM: C316.1 C317.1 ; port VCCBRAM
VCCINT: C310.1 C311.1 C312.1 C313.1 C314.1 C315.1 C476.1 C477.1 ; port VCCINT
VCCO0: C436.1 ; port VCCO0
VCCO14: C437.1 C438.1 C439.1 C440.1 C441.1 C442.1 C443.1 ; port VCCO14
VCCO15: C444.1 C445.1 C446.1 C447.1 C448.1 C449.1 C450.1 ; port VCCO15
VCCO16: C451.1 C452.1 C453.1 C454.1 C455.1 ; port VCCO16
VCCO34: C456.1 C457.1 C458.1 C459.1 C460.1 C461.1 C462.1 ; port VCCO34
VCCO35: C463.1 C464.1 C465.1 C466.1 C467.1 C468.1 C469.1 ; port VCCO35

### Notes on the sheet
- designed by
- reviewed by
- last drawn by
- Project:
- Schematic:
- last printed
- DIN-A4 P
- sheets
- of
- File:

### Library data of the parts
C310 = CAP: CAP CER 47UF 10V X5R 1206; MFR-PN: GRM32ER71A476KE15L; MFR: MURATA; MFR-TYPE: GRM series; 04. Manufacturer: Samsung Electro-Mechanics; 07. Manufacturer  Part Number: CL31A476MPHNNNE; POPULATED: yes; Parameters: X7R, 10V, 10%; 03. Unit Price: 0.64; Tolerance: ±20%; Type: X7R; 3D-Export: No; Temperature Range: -55°C ~ 85°C; 01. Distributor: DigiKey; 02. Distributor Part Number: 1276-3063-6-ND; 09. Operating Temperature: -55°C ~ 85°C; 11. RoHS: YES; ComponentLink1Description: Info; ComponentLink1URL: https://www.digikey.de/product-detail/en/murata-electronics-north-america/GRM32EC70J107ME15L/490-10530-6-ND/5027076; Voltage Rating: 10V; ComponentLink4Description: Info; ComponentLink4URL: https://www.digikey.de/product-detail/en/samsung-electro-mechanics/CL31A476MPHNNNE/1276-3063-6-ND/3893578; ComponentLink5Description: DataSheet; ComponentLink5URL: https://media.digikey.com/pdf/Data%20Sheets/Samsung%20PDFs/CL_Series_MLCC_ds.pdf
C311-C313 C430 C431 C438 C439 C445 C446 C452 C453 C457 C458 C464 C465 C470 C471 C476 C477 = CAP: CAP CER 4.7UF 6.3V X5R 0402; 04. Manufacturer: Samsung Electro-Mechanics; 07. Manufacturer  Part Number: CL05A475KQ5NRNC; POPULATED: yes; Parameters: X7R, 6V3, 10%; 03. Unit Price: 0.28; Tolerance: 10%; Type: X7R; Voltage Rating: 6V3; 3D-Export: No; Temperature Range: -40°C/+85°C; 01. Distributor: DigiKey; 02. Distributor Part Number: 1276-1481-6-ND; 09. Operating Temperature: -55°C ~ 85°C; 11. RoHS: YES; ComponentLink4Description: DataSheet; ComponentLink4URL: https://media.digikey.com/pdf/Data%20Sheets/Samsung%20PDFs/CL_Series_MLCC_ds.pdf; ComponentLink5Description: Info; ComponentLink5URL: https://www.digikey.de/product-detail/en/samsung-electro-mechanics/CL05A475KQ5NRNC/1276-1481-6-ND/3891995
C314 C315 C317 C432-C435 C440-C443 C447-C450 C454 C455 C459-C462 C466-C469 = CAP: CAP CER 0.47UF 10V X5R 0402; 04. Manufacturer: Samsung Electro-Mechanics; 07. Manufacturer  Part Number: CL05A474KP5NNNC; POPULATED: yes; Parameters: X5R, 10V, 10%; 03. Unit Price: 0.09; Tolerance: 10%; 3D-Export: No; Temperature Range: -55°C ~ 85°C; 01. Distributor: DigiKey; 02. Distributor Part Number: 1276-1173-6-ND; 09. Operating Temperature: -55°C ~ 85°C; 11. RoHS: YES; Type: X5R; Voltage Rating: 10V; ComponentLink4Description: Info; ComponentLink4URL: https://www.digikey.de/product-detail/en/samsung-electro-mechanics/CL05A474KP5NNNC/1276-1173-6-ND/3891687; ComponentLink5Description: DataSheet; ComponentLink5URL: https://media.digikey.com/pdf/Data%20Sheets/Samsung%20PDFs/CL_Series_MLCC_ds.pdf
C316 C318 C436 C437 C444 C451 C456 C463 = CAP: CAP CER 47UF 10V X5R 0805; MFR-PN: GRM32ER71A476KE15L; MFR: MURATA; MFR-TYPE: GRM series; 04. Manufacturer: Murata Electronics North America; 07. Manufacturer  Part Number: GRM21BR61A476ME15L; POPULATED: yes; Parameters: X7R, 10V, 10%; 03. Unit Price: 0.67; Tolerance: ±20%; Type: X7R; 3D-Export: No; Temperature Range: -55°C ~ 85°C; 01. Distributor: DigiKey; 02. Distributor Part Number: 490-9961-6-ND; 09. Operating Temperature: -55°C ~ 85°C; 11. RoHS: YES; Voltage Rating: 10V; ComponentLink4Description: Info; ComponentLink4URL: https://www.digikey.de/product-detail/en/murata-electronics-north-america/GRM21BR61A476ME15L/490-9961-6-ND/5027050; ComponentLink5Description: DataSheet; ComponentLink5URL: https://search.murata.co.jp/Ceramy/image/img/A01X/G101/ENG/GRM21BR61A476ME15-01.pdf

## Sheet PCB-Tester-Board-V1.SchDoc
size A4; DateDraw: Date Draw; DateChecked: Date Review; Workspace: Workspace; TitleTyp: Title-Typ; PageSetup: Record=PageOptions|CenterHorizontal=True|CenterVertical=True|PrintScale=0.97|XCorrection=1.00|YCorrection=1.00|PrintKind=0|BorderSize=5000000|LeftOffset=0|BottomOffset=0|Orientation=2|PaperLength=1000|PaperWidth=1000|Scale=100|PaperSource=7|PrintQuality=-3|MediaType=1|DitherType=10|PrintScaleMode=1|PaperKind=A4|PaperIndex=9
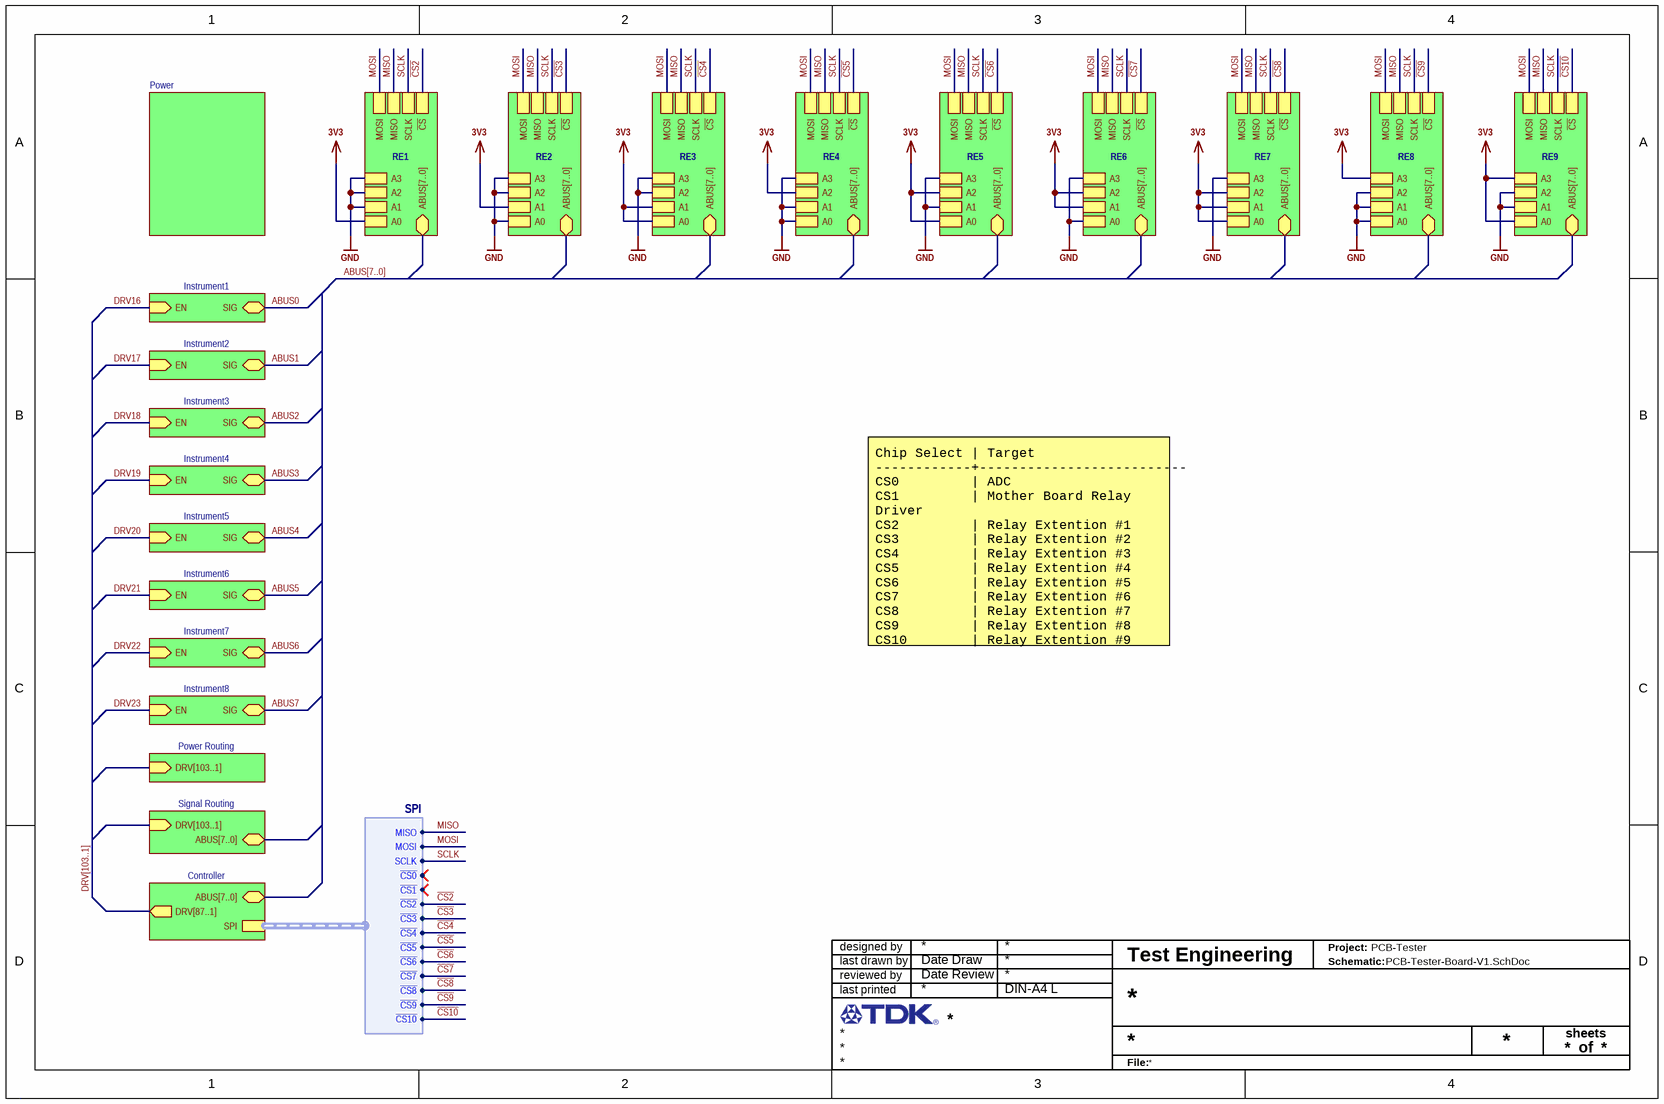
[diagram p2: PCB-Tester-Board-V1.SchDoc]

### Sub-sheets
Controller = Controller.SchDoc: ABUS[7..0] (bidir), SPI (harness SPI), DRV[87..1] (out)
Instrument1 = Instrument.SchDoc: EN (in), SIG (bidir)
Instrument2 = Instrument.SchDoc: EN (in), SIG (bidir)
Instrument3 = Instrument.SchDoc: EN (in), SIG (bidir)
Instrument4 = Instrument.SchDoc: EN (in), SIG (bidir)
Instrument5 = Instrument.SchDoc: EN (in), SIG (bidir)
Instrument6 = Instrument.SchDoc: EN (in), SIG (bidir)
Instrument7 = Instrument.SchDoc: EN (in), SIG (bidir)
Instrument8 = Instrument.SchDoc: EN (in), SIG (bidir)
Power = Power.SchDoc (file not in this document): no entries
Power Routing = PowerRouting.SchDoc: DRV[103..1] (in)
RE1 = RelayExtension.SchDoc (file not in this document): ABUS[7..0] (bidir), SCLK, ~{CS}, MISO, MOSI, A3, A2, A1, A0
RE2 = RelayExtension.SchDoc (file not in this document): ABUS[7..0] (bidir), MOSI, MISO, ~{CS}, SCLK, A2, A3, A1, A0
RE3 = RelayExtension.SchDoc (file not in this document): ABUS[7..0] (bidir), MISO, SCLK, ~{CS}, MOSI, A2, A3, A1, A0
RE4 = RelayExtension.SchDoc (file not in this document): ABUS[7..0] (bidir), ~{CS}, SCLK, MOSI, MISO, A0, A1, A2, A3
RE5 = RelayExtension.SchDoc (file not in this document): ABUS[7..0] (bidir), SCLK, MISO, MOSI, ~{CS}, A3, A2, A1, A0
RE6 = RelayExtension.SchDoc (file not in this document): ABUS[7..0] (bidir), MOSI, ~{CS}, MISO, SCLK, A3, A0, A1, A2
RE7 = RelayExtension.SchDoc (file not in this document): ABUS[7..0] (bidir), MOSI, SCLK, MISO, ~{CS}, A0, A1, A2, A3
RE8 = RelayExtension.SchDoc (file not in this document): ABUS[7..0] (bidir), MOSI, MISO, ~{CS}, SCLK, A3, A2, A1, A0
RE9 = RelayExtension.SchDoc (file not in this document): ABUS[7..0] (bidir), MISO, SCLK, MOSI, ~{CS}, A3, A2, A1, A0
Signal Routing = SignalRouting.SchDoc: ABUS[7..0] (bidir), DRV[103..1] (in)

### Harnesses
SPI: MISO, MOSI, SCLK, ~{CS0}, ~{CS1}, ~{CS2}, ~{CS3}, ~{CS4}, ~{CS5}, ~{CS6}, ~{CS7}, ~{CS8}, ~{CS9}, ~{CS10}

### Nets
3V3: sheet RE2/A1, sheet RE3/A1, sheet RE3/A0, sheet RE4/A2, sheet RE5/A2, sheet RE5/A0, sheet RE6/A1, sheet RE6/A2, sheet RE7/A0, sheet RE7/A1, sheet RE7/A2, sheet RE8/A3, sheet RE1/A0, sheet RE9/A3, sheet RE9/A0
GND: sheet RE2/A2, sheet RE2/A3, sheet RE2/A0, sheet RE3/A2, sheet RE3/A3, sheet RE4/A0, sheet RE4/A1, sheet RE4/A3, sheet RE5/A3, sheet RE5/A1, sheet RE6/A3, sheet RE6/A0, sheet RE7/A3, sheet RE8/A2, sheet RE8/A1, sheet RE8/A0, sheet RE1/A3, sheet RE1/A2, sheet RE1/A1, sheet RE9/A2, sheet RE9/A1
~{CS2}: sheet RE1/~{CS}, sheet Controller/SPI.~{CS2}
~{CS3}: sheet RE2/~{CS}, sheet Controller/SPI.~{CS3}
~{CS4}: sheet RE3/~{CS}, sheet Controller/SPI.~{CS4}
~{CS5}: sheet RE4/~{CS}, sheet Controller/SPI.~{CS5}
~{CS6}: sheet RE5/~{CS}, sheet Controller/SPI.~{CS6}
~{CS7}: sheet RE6/~{CS}, sheet Controller/SPI.~{CS7}
~{CS8}: sheet RE7/~{CS}, sheet Controller/SPI.~{CS8}
~{CS9}: sheet RE8/~{CS}, sheet Controller/SPI.~{CS9}
~{CS10}: sheet RE9/~{CS}, sheet Controller/SPI.~{CS10}
MISO: sheet RE2/MISO, sheet RE3/MISO, sheet RE4/MISO, sheet RE5/MISO, sheet RE6/MISO, sheet RE7/MISO, sheet RE8/MISO, sheet RE1/MISO, sheet RE9/MISO, sheet Controller/SPI.MISO
MOSI: sheet RE2/MOSI, sheet RE3/MOSI, sheet RE4/MOSI, sheet RE5/MOSI, sheet RE6/MOSI, sheet RE7/MOSI, sheet RE8/MOSI, sheet RE1/MOSI, sheet RE9/MOSI, sheet Controller/SPI.MOSI
SCLK: sheet RE2/SCLK, sheet RE3/SCLK, sheet RE4/SCLK, sheet RE5/SCLK, sheet RE6/SCLK, sheet RE7/SCLK, sheet RE8/SCLK, sheet RE1/SCLK, sheet RE9/SCLK, sheet Controller/SPI.SCLK

### Buses and harness runs
bus ABUS[7..0] = sheet Controller/ABUS[7..0] = sheet RE1/ABUS[7..0] = sheet RE2/ABUS[7..0] = sheet RE3/ABUS[7..0] = sheet RE4/ABUS[7..0] = sheet RE5/ABUS[7..0] = sheet RE6/ABUS[7..0] = sheet RE7/ABUS[7..0] = sheet RE8/ABUS[7..0] = sheet RE9/ABUS[7..0] = sheet Signal Routing/ABUS[7..0]
bus DRV[103..1] = sheet Controller/DRV[87..1] = sheet Power Routing/DRV[103..1] = sheet Signal Routing/DRV[103..1]

### Notes on the sheet
- Chip Select | Target
  ------------+--------------------------
  CS0         | ADC
  CS1         | Mother Board Relay Driver
  CS2         | Relay Extention #1
  CS3         | Relay Extention #2
  CS4         | Relay Extention #3
  CS5         | Relay Extention #4
  CS6         | Relay Extention #5
  CS7         | Relay Extention #6
  CS8         | Relay Extention #7
  CS9         | Relay Extention #8
  CS10        | Relay Extention #9
- designed by
- reviewed by
- last drawn by
- Project:
- Schematic:
- last printed
- DIN-A4 L
- sheets
- of
- File:

## Sheet Instrument.SchDoc
size A4; DateDraw: Date Draw; DateChecked: Date Review; Workspace: Workspace; TitleTyp: Title-Typ; PageSetup: Record=PageOptions|CenterHorizontal=True|CenterVertical=True|PrintScale=0.97|XCorrection=1.00|YCorrection=1.00|PrintKind=0|BorderSize=5000000|LeftOffset=0|BottomOffset=0|Orientation=2|PaperLength=1000|PaperWidth=1000|Scale=100|PaperSource=7|PrintQuality=-3|MediaType=1|DitherType=10|PrintScaleMode=1|PaperKind=A4|PaperIndex=9
Used 8 times, as channels Instrument1, Instrument2, Instrument3, Instrument4, Instrument5, Instrument6, Instrument7, Instrument8. Parts and nets are listed once, with the designators drawn on the sheet.
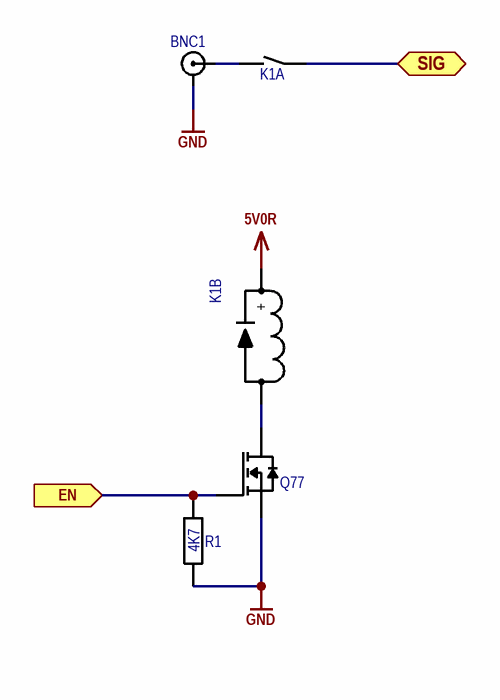
[diagram p3: Instrument.SchDoc]

### Parts
BNC1  X  [BNC]  (value not drawn)
K1  K  [118-1A]  (value not drawn)  (parts A,B of 2)
Q77  Q  [SOT23-3]  (value not drawn)
R1  value 4K7  [R0402 Reflow]  (hidden comment: R)

### Ports
EN (in), SIG (bidir)

### Nets
5V0R: K1.1(+)
GND: BNC1.0 Q77.2(S) R1.1
EN: Q77.1(G) R1.2 ; port EN
SIG: K1.4(CB) ; port SIG
NetBNC1_1: BNC1.1 K1.3(CA)
NetK1_2: K1.2(-) Q77.3(D)

### Channels
Instrument1: designators end in _Instrument1; ports EN=DRV16 SIG=ABUS0
Instrument2: designators end in _Instrument2; ports EN=DRV1 SIG=ABUS1
Instrument3: designators end in _Instrument3; ports EN=DRV18 SIG=ABUS2
Instrument4: designators end in _Instrument4; ports EN=DRV19 SIG=ABUS3
Instrument5: designators end in _Instrument5; ports EN=DRV100 SIG=ABUS4
Instrument6: designators end in _Instrument6; ports EN=DRV101 SIG=ABUS5
Instrument7: designators end in _Instrument7; ports EN=DRV102 SIG=ABUS6
Instrument8: designators end in _Instrument8; ports EN=DRV103 SIG=ABUS7

### Notes on the sheet
- designed by
- reviewed by
- last drawn by
- Project:
- Schematic:
- last printed
- DIN-A4 L
- sheets
- of
- File:

### Library data of the parts
BNC1 = BNC: BNC Connector; 07. Manufacturer  Part Number: [see model description]; 13. Created Date/Name: AUG 2018 / Hören; ComponentLink1Description: Info; 01. Distributor: DigiKey; ComponentLink2Description: DataSheet; ComponentLink3Description: FootPrint; System: Connector
K1 = 118-1-A-5/2D: 5V Signal Relais, Normal Open; 04. Manufacturer: Pickering; 03. Unit Price: 2.60; 05. Quantity: 1000; 06. Data Sheet: Pickering_series_118.pdf; 13. Created Date/Name: 20.12.17 S. Kaiser; Coil Resistance: 1500 Ohm; Max Carry Current: 1.2 A; Max Switch Current: 1A; Max Switch Voltage: 200V; Power Rating: 15W; 01. Distributor: Pickering; 02. Distributor Part Number: 118-1-A-5/2D; 07. Manufacturer  Part Number: 118-1-A-5/2D; 09. Operating Temperature: -20°C ~ +85°C; 11. RoHS: 2011/65/EU; ComponentLink1Description: Info; ComponentLink1URL: http://www.pickeringrelay.com/; ComponentLink2Description: DataSheet; ComponentLink2URL: https://www.pickeringrelay.com/products/single-line-sil-series-111-119/single-line-sil-series-118/; Coil Voltage: 5V
Q77 = FDV303N: MOSFET N-CH 25V 680MA SOT-23; 04. Manufacturer: ON Semiconductor; 03. Unit Price: 0.41; 13. Created Date/Name: AUG 2018 / Hören; Rds On: 450 mΩ @ id=500mA & Vgs=4.5V; Vgs,th: 1.5V @ 250uA; Power Rating: 350mW; 3D-Export: No; 01. Distributor: DigiKey; 02. Distributor Part Number: FDV303NDKR-ND; 07. Manufacturer  Part Number: FDV303N; 09. Operating Temperature: -55°C ~ 150°C (TJ); 11. RoHS: YES; ComponentLink1Description: Info; ComponentLink1URL: https://www.digikey.de/product-detail/en/on-semiconductor/FDV303N/FDV303NDKR-ND/1630434; ComponentLink2Description: DataSheet; ComponentLink2URL: https://media.digikey.com/pdf/Data%20Sheets/Fairchild%20PDFs/FDV303N.pdf; Vdss: 25V; Id: 680mA
R1 = R: Resistor; Tolerance: ±1%; 13. Created Date/Name: AUG2018/Hören; ComponentLink1URL: *; ComponentLink1Description: Info; 09. Operating Temperature: -xx..+yy°C; 11. RoHS: ???; ComponentLink2Description: DataSheet; Package: *

## Sheet Controller.SchDoc
size A4; DateDraw: Date Draw; DateChecked: Date Review; Workspace: Workspace; TitleTyp: Title-Typ; PageSetup: Record=PageOptions|CenterHorizontal=True|CenterVertical=True|PrintScale=0.97|XCorrection=1.00|YCorrection=1.00|PrintKind=0|BorderSize=5000000|LeftOffset=0|BottomOffset=0|Orientation=2|PaperLength=1000|PaperWidth=1000|Scale=100|PaperSource=7|PrintQuality=-3|MediaType=1|DitherType=10|PrintScaleMode=1|PaperKind=A4|PaperIndex=9
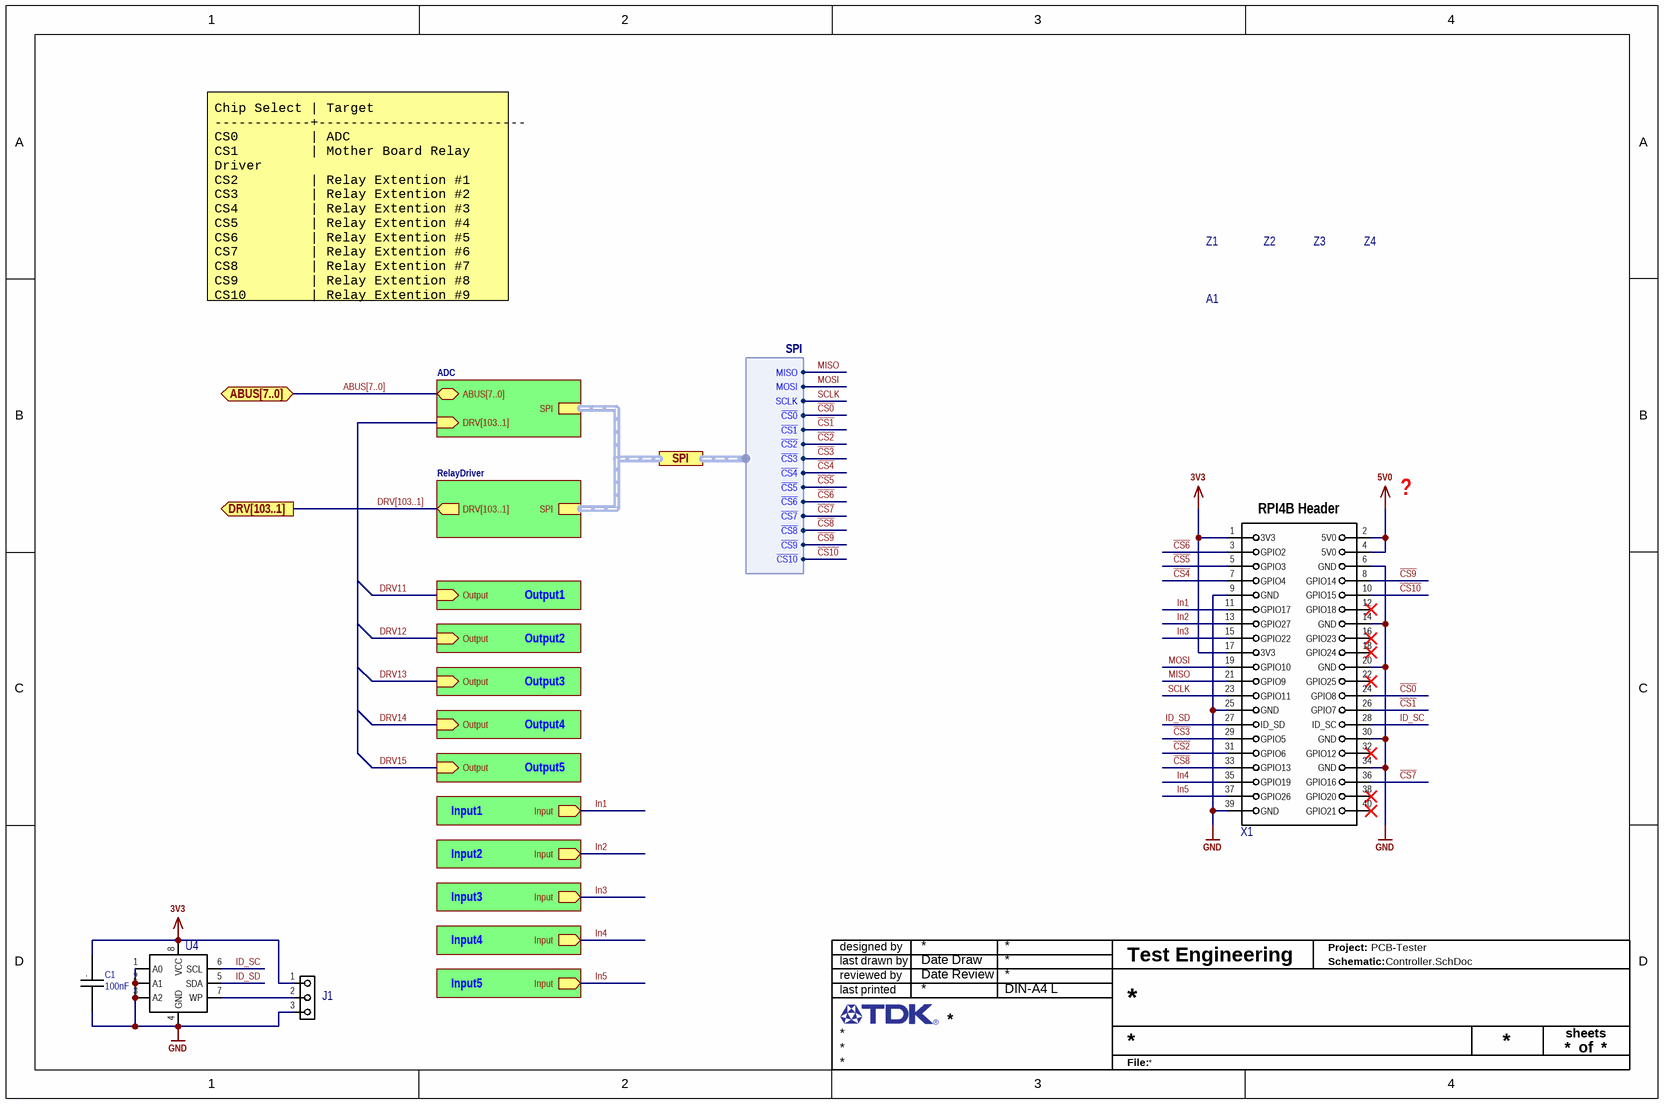
[diagram p4: Controller.SchDoc]

### Parts
A1  A  [RPI4B]  (value not drawn)
C1  value 100nF  [C0402 Reflow]  (hidden comment: C)
J1  J  [Header 100mil 3x1]  (value not drawn)
U4  U  [SOIC8 (R-8)]  (value not drawn)
X1  X  [RPI4B Footprint]  (value not drawn)
Z1  Z  [HSM2.5-6.4-16-2]  (value not drawn)
Z2  Z  [HSM2.5-6.4-16-2]  (value not drawn)
Z3  Z  [HSM2.5-6.4-16-2]  (value not drawn)
Z4  Z  [HSM2.5-6.4-16-2]  (value not drawn)

### Sub-sheets
ADC = ADC.SchDoc: ABUS[7..0] (bidir), SPI (harness SPI), DRV[103..1] (in)
Input = Input.SchDoc: Input (out)
Input = Input.SchDoc: Input (out)
Input = Input.SchDoc: Input (out)
Input = Input.SchDoc: Input (out)
Input = Input.SchDoc: Input (out)
Output = Output.SchDoc: Output (in)
Output = Output.SchDoc: Output (in)
Output = Output.SchDoc: Output (in)
Output = Output.SchDoc: Output (in)
Output = Output.SchDoc: Output (in)
RelayDriver = RelayDriver.SchDoc: SPI (harness SPI), DRV[103..1] (out)

### Ports
ABUS[7..0] (bidir), DRV[103..1] (out), SPI (harness SPI)

### Harnesses
SPI: MISO, MOSI, SCLK, ~{CS0}, ~{CS1}, ~{CS2}, ~{CS3}, ~{CS4}, ~{CS5}, ~{CS6}, ~{CS7}, ~{CS8}, ~{CS9}, ~{CS10}

### Nets
3V3: C1.1 J1.1 U4.8(VCC) X1.1(3V3) X1.17(3V3)
5V0: X1.2(5V0) X1.4(5V0)
GND: C1.2 J1.3 U4.1(A0) U4.2(A1) U4.3(A2) U4.4(GND) X1.6(GND) X1.9(GND) X1.14(GND) X1.20(GND) X1.25(GND) X1.30(GND) X1.34(GND) X1.39(GND)
~{CS0}: X1.24(GPIO8) ; port SPI.~{CS0}
~{CS1}: X1.26(GPIO7) ; port SPI.~{CS1}
~{CS2}: X1.31(GPIO6) ; port SPI.~{CS2}
~{CS3}: X1.29(GPIO5) ; port SPI.~{CS3}
~{CS4}: X1.7(GPIO4) ; port SPI.~{CS4}
~{CS5}: X1.5(GPIO3) ; port SPI.~{CS5}
~{CS6}: X1.3(GPIO2) ; port SPI.~{CS6}
~{CS7}: X1.36(GPIO16) ; port SPI.~{CS7}
~{CS8}: X1.33(GPIO13) ; port SPI.~{CS8}
~{CS9}: X1.8(GPIO14) ; port SPI.~{CS9}
~{CS10}: X1.10(GPIO15) ; port SPI.~{CS10}
ID_SC: U4.6(SCL) X1.28(ID_SC)
ID_SD: U4.5(SDA) X1.27(ID_SD)
In1: X1.11(GPIO17) ; sheet Input/Input
In2: X1.13(GPIO27) ; sheet Input/Input
In3: X1.15(GPIO22) ; sheet Input/Input
In4: X1.35(GPIO19) ; sheet Input/Input
In5: X1.37(GPIO26) ; sheet Input/Input
MISO: X1.21(GPIO9) ; port SPI.MISO
MOSI: X1.19(GPIO10) ; port SPI.MOSI
SCLK: X1.23(GPIO11) ; port SPI.SCLK
NetJ1_2: J1.2 U4.7(WP)

Not connected (* = marked no-connect by the designer): X1 12(GPIO18)* 16(GPIO23)* 18(GPIO24)* 22(GPIO25)* 32(GPIO12)* 38(GPIO20)* 40(GPIO21)*

### Buses and harness runs
bus ABUS[7..0] = port ABUS[7..0] = sheet ADC/ABUS[7..0]
bus DRV[103..1] = port DRV[103..1] = sheet ADC/DRV[103..1] = sheet RelayDriver/DRV[103..1]
harness port SPI = sheet ADC/SPI = sheet RelayDriver/SPI

### Notes on the sheet
- Chip Select | Target
  ------------+--------------------------
  CS0         | ADC
  CS1         | Mother Board Relay Driver
  CS2         | Relay Extention #1
  CS3         | Relay Extention #2
  CS4         | Relay Extention #3
  CS5         | Relay Extention #4
  CS6         | Relay Extention #5
  CS7         | Relay Extention #6
  CS8         | Relay Extention #7
  CS9         | Relay Extention #8
  CS10        | Relay Extention #9
- ?
- Output1
- Output2
- Output3
- Output4
- Output5
- Input1
- Input2
- Input3
- Input4
- Input5
- designed by
- reviewed by
- last drawn by
- Project:
- Schematic:
- last printed
- DIN-A4 L
- sheets
- of
- File:
- (in symbol C) .
- (in symbol RPI4B Footprint) RPI4B Header

### Library data of the parts
A1 = RPI4B: RASPBERRY PI 4 MODEL B 4GB SDRAM; 03. Unit Price: 60.53; 13. Created Date/Name: ??? / Hören; 01. Distributor: DigiKey; 02. Distributor Part Number: 1690-RASPBERRYPI4B/4GB-ND; 04. Manufacturer: Raspberry Pi; ComponentLink1Description: Info; ComponentLink1URL: https://www.digikey.de/products/en/development-boards-kits-programmers/evaluation-boards-embedded-mcu-dsp/786?k=Raspberry&k=&pkeyword=Raspberry&sv=0&pv1742=392511&sf=0&FV=-8%7C786&quantity=&ColumnSort=0&page=1&pageSize=25; ComponentLink2Description: DataSheet; ComponentLink2URL: https://www.raspberrypi.org/documentation/hardware/raspberrypi/bcm2711/rpi_DATA_2711_1p0_preliminary.pdf
C1 = C: Capacitor Unpolarized; Tolerance: ±20%; 13. Created Date/Name: AUG2018/Hören; ComponentLink1Description: Info; ComponentLink1URL: *; 09. Operating Temperature: -xx..+yy°C; 11. RoHS: ???; ComponentLink2Description: DataSheet
J1 = Header 3Pins 100mil: CONN HEADER VERT 3POS 2.54MM; 04. Manufacturer: Samtec Inc.; 07. Manufacturer  Part Number: HMTSW-103-07-G-S-240; 03. Unit Price: 0.25; 13. Created Date/Name: AUG2018/Hören; 01. Distributor: Samtec Inc.; 02. Distributor Part Number: HMTSW-103-07-G-S-240; 11. RoHS: YES; ComponentLink1Description: Info; ComponentLink1URL: https://www.samtec.com/products/hmtsw-103-07-g-s-240; ComponentLink2Description: DataSheet; ComponentLink2URL: http://suddendocs.samtec.com/catalog_english/hmtsw.pdf
U4 = 24LC256T-I/SN: IC EEPROM 256K I2C 400KHZ 8SOIC; 04. Manufacturer: Microchip Technology; 03. Unit Price: 0.71; 13. Created Date/Name: AUG 2018 / Hören; 01. Distributor: DigiKey; 02. Distributor Part Number: 24LC256T-I/SNDKR-ND; 07. Manufacturer  Part Number: 24LC256T-I/SN; 11. RoHS: YES; ComponentLink1Description: Info; ComponentLink1URL: https://www.digikey.de/product-detail/en/microchip-technology/24LC256T-I-SN/24LC256T-I-SNDKR-ND/1850685; ComponentLink2Description: DataSheet; ComponentLink2URL: http://ww1.microchip.com/downloads/en/DeviceDoc/24AA256-24LC256-24FC256-Data-Sheet-20001203W.pdf; Package: SOIC8
X1 = RPI4B Footprint: 40 Position Elevated Socket Connector  Through Hole; 04. Manufacturer: Samtec Inc.; 03. Unit Price: 5.34; 13. Created Date/Name: ??? / Hören; 01. Distributor: Samtec; 02. Distributor Part Number: ESW-120-23-L-D-LL; ComponentLink1Description: Info; ComponentLink1URL: https://www.samtec.com/products/esw-120-23-l-d-ll; ComponentLink2Description: DataSheet; ComponentLink2URL: http://suddendocs.samtec.com/catalog_english/esw_th.pdf; System: Connector
Z1-Z4 = HSM2.5-6.4-16-2: HEX STANDOFF M2.5 BRASS 16MM; 04. Manufacturer: Essentra Components; 03. Unit Price: 2.69; 13. Created Date/Name: ??? / Hören; 01. Distributor: DigiKey; 02. Distributor Part Number: HSM2.5-6.4-16-2-ND; 07. Manufacturer  Part Number: HSM2.5-6.4-16-2; ComponentLink1Description: Info; ComponentLink1URL: https://www.digikey.de/products/en/hardware-fasteners-accessories/board-spacers-standoffs/582?k=standoff&k=&pkeyword=standoff&sv=0&pv741=29561&sf=0&FV=29%7C371405%2C1839%7C370197%2C1989%7C0%2C-8%7C582&quantity=&ColumnSort=-1000009&page=1&pageSize=25; ComponentLink2Description: DataSheet; ComponentLink2URL: https://www.essentracomponents.com.sg/images-line/pdfs/HTNSP.pdf